# EAGLE design TeamH-PDS (EAGLE 9.6.2)
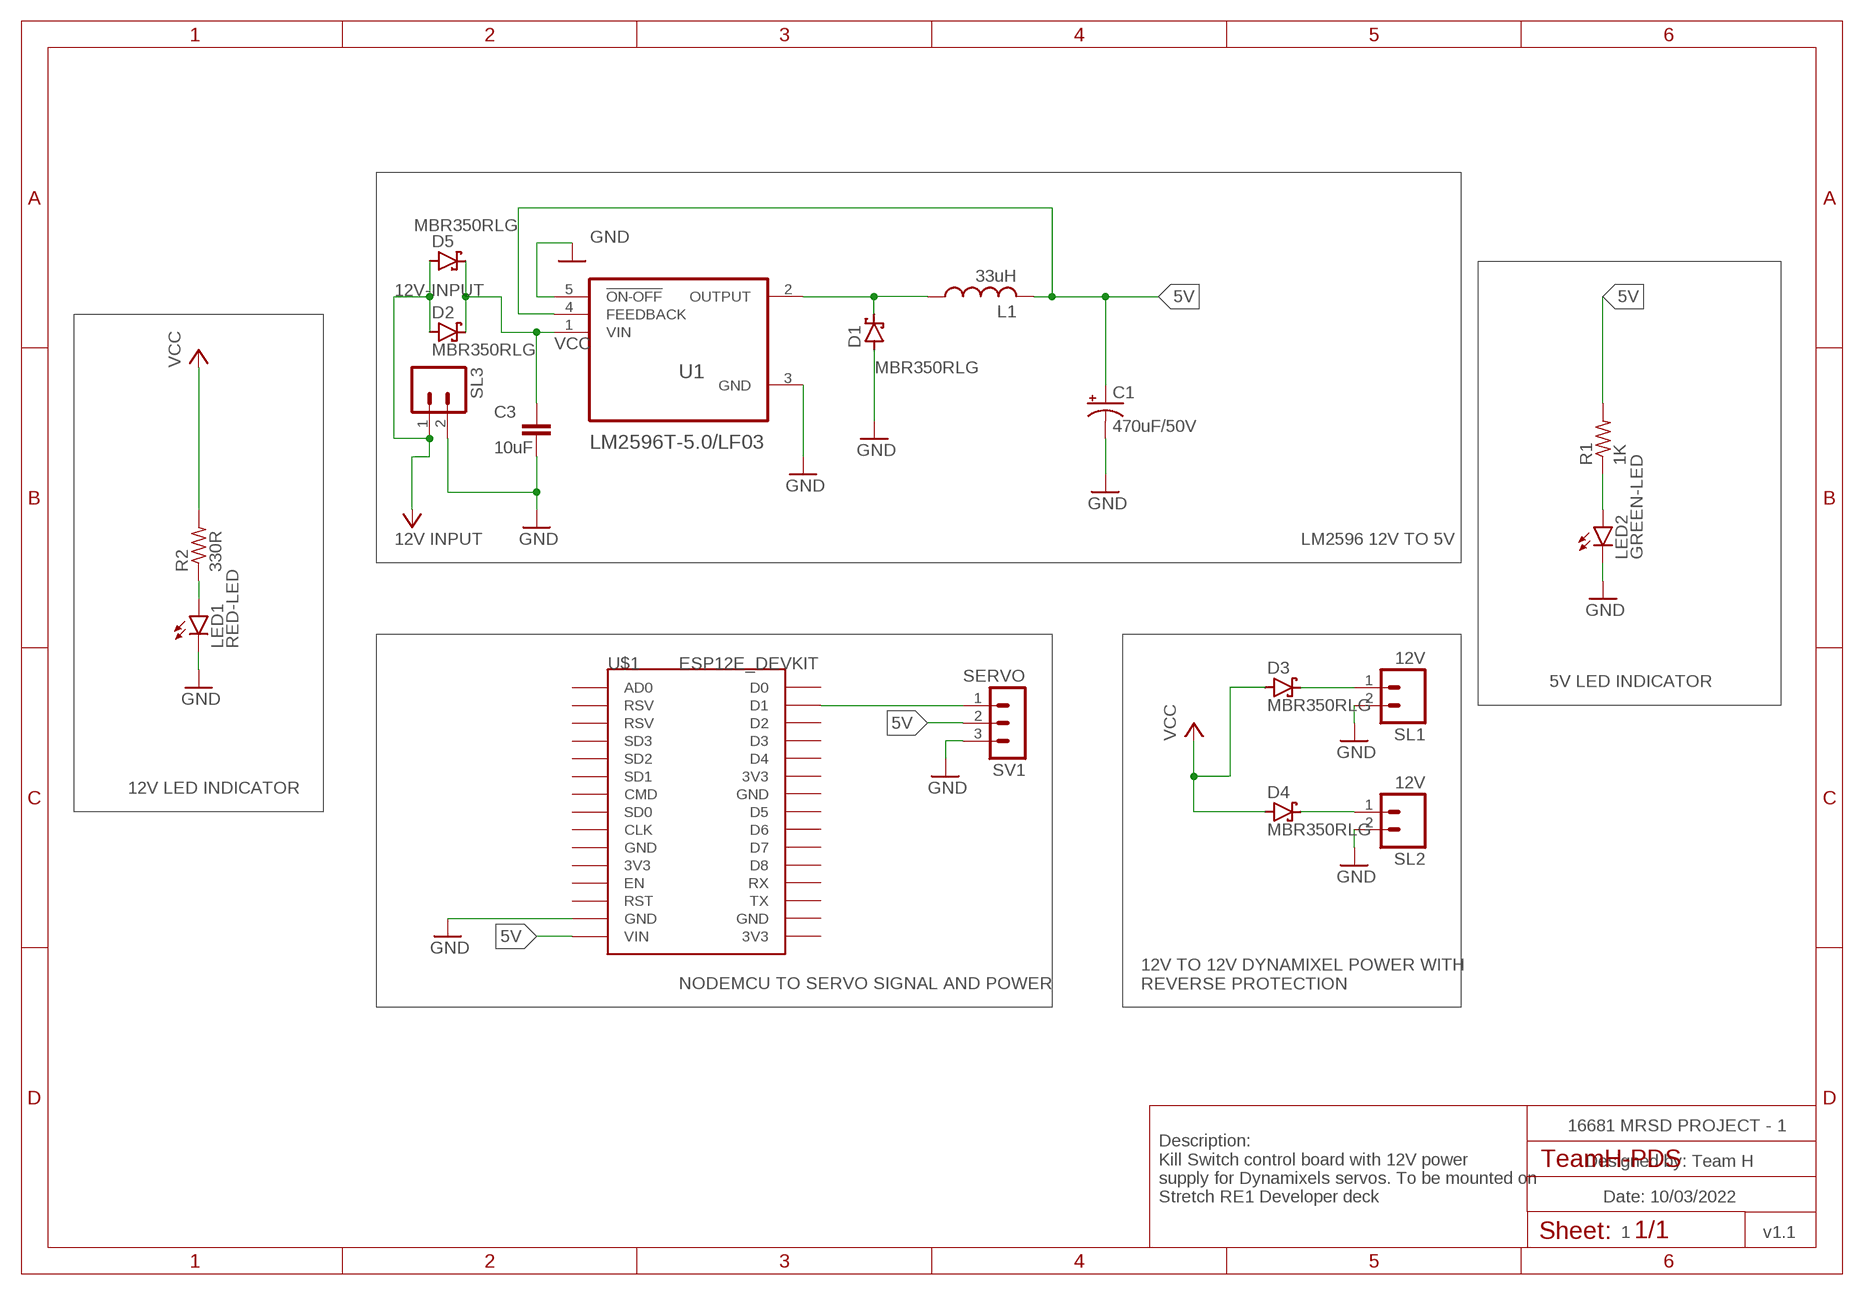
[diagram p0: schematic, sheet 1]

## Parts
C1  470uF/50V  CPOL-USE2-5  [E2-5]
C3  10uF  C2,5-3  [C2.5-3]
D1  MBR350RLG  1N5908  [C4111-15]
D2  MBR350RLG  1N5908  [C4111-15]
D3  MBR350RLG  1N5908  [C4111-15]
D4  MBR350RLG  1N5908  [C4111-15]
D5  MBR350RLG  1N5908  [C4111-15]
L1  33uH  L-US0207/7  [0207/7]
LED1  RED-LED  LED5MM  [LED5MM]
LED2  GREEN-LED  LED5MM  [LED5MM]
R1  1K  R-US_0204/5  [0204/5]
R2  330R  R-US_0204/5  [0204/5]
SL1  12V  M02  [02P]
SL2  12V  M02  [02P]
SL3  12V-INPUT  M02  [02P]
SV1  SERVO  MA03-1  [MA03-1]
U1  LM2596T-5.0/LF03  [TO170P1016X470X2092-5]
U$1  ESP12E_DEVKIT  [ESP12E_DEVKIT]

## Nets
5V: C1.+ L1.2 R1.2 SV1.2 U1.4(FEEDBACK) U$1.VIN
GND: C1.- C3.2 D1.A LED1.K(C) LED2.K(C) SL1.2 SL2.2 SL3.2 SV1.3 U1.3(GND) U1.5(!ON-OFF) U$1.GND@1(GND)
N$1: SV1.1 U$1.D1
N$3: D1.C L1.1 U1.2(OUTPUT)
N$4: LED1.A R2.1
N$5: D3.C SL1.1
N$6: D4.C SL2.1
N$7: C3.1 D2.C D5.C U1.1(VIN)
N$21: LED2.A R1.1
VCC: D2.A D3.A D4.A D5.A R2.2 SL3.1
Unconnected: U$1.3V3@0(3V3) U$1.3V3@1(3V3) U$1.3V3@2(3V3) U$1.AD0 U$1.CLK U$1.CMD U$1.D0 U$1.D2 U$1.D3 U$1.D4 U$1.D5 U$1.D6 U$1.D7 U$1.D8 U$1.EN U$1.GND@0(GND) U$1.GND@2(GND) U$1.GND@3(GND) U$1.RST U$1.RSV@0(RSV) U$1.RSV@1(RSV) U$1.RX U$1.SD0 U$1.SD1 U$1.SD2 U$1.SD3 U$1.TX

## Notes on the sheet
- 12V INPUT | LM2596 12V TO 5V
- 5V LED INDICATOR
- 12V LED INDICATOR
- NODEMCU TO SERVO SIGNAL AND POWER
- 12V TO 12V DYNAMIXEL POWER WITH 
  REVERSE PROTECTION
- 16681 MRSD PROJECT - 1
- Designed by: Team H
- Description:
  Kill Switch control board with 12V power 
  supply for Dynamixels servos. To be mounted on 
  Stretch RE1 Developer deck
- Date: 10/03/2022
- 1 | v1.1

## Library data of the parts
C1 = rcl:CPOL-US: POLARIZED CAPACITOR, American symbol; SPICEPREFIX: C
C3 = capacitor-wima:C: CAPACITOR naming: grid - package width
D1-D5 = diode:1N5908: DIODE schottky
L1 = rcl:L-US: INDUCTOR, American symbol; SPICEPREFIX: L
LED1 LED2 = led:LED: LED OSRAM: - CHIPLED LG R971, LG N971, LY N971, LG Q971, LY Q971, LO R971, LY R971 LH N974, LH R974 LS Q976, LO Q976, LY Q976 LO Q996 - Hyper CHIPLED LW Q18S LB Q993, LB Q99A, LB R99A - SideLED LS A670, LO A670, LY A670, LG A670, LP A670 LB A673, LV A673, LT A673, LW A673 LH A674 LY A675 LS A676, LA A676, LO A676, LY A676, LW A676 LS A679, LY A679, LG A679 - Hyper Micro SIDELED® LS Y876, LA Y876, LO Y876, LY Y876 LT Y87S - SmartLED LW L88C, LW L88S LB L89C, LB L89S, LG L890 LS L89K, LO L89K, LY L89K LS L896, LA L896, LO L896, LY L896 - TOPLED LS T670, LO T670, LY T670, LG T670, LP T670 LSG T670, LSP T670, LSY T670, LOP T670, LYG T670 LG T671, LOG T671, LSG T671 LB T673, LV T673, LT T673, LW T673 LH T674 LS T676, LA T676, LO T676, LY T676, LB T676, LH T676, LSB T676, LW T676 LB T67C, LV T67C, LT T67C, LS T67K, LO T67K, LY T67K, LW E67C LS E67B, LA E67B, LO E67B, LY E67B, LB E67C, LV E67C, LT E67C LW T67C LS T679, LY T679, LG T679 LS T770, LO T770, LY T770, LG T770, LP T770 LB T773, LV T773, LT T773, LW T773 LH T774 LS E675, LA E675, LY E675, LS T675 LS T776, LA T776, LO T776, LY T776, LB T776 LHGB T686 LT T68C, LB T68C - Hyper Mini TOPLED® LB M676 - Mini TOPLED Santana® LG M470 LS M47K, LO M47K, LY M47K Source: http://www.osram.convergy.de LUXEON: - LUMILED® LXK2-PW12-R00, LXK2-PW12-S00, LXK2-PW14-U00, LXK2-PW14-V00 LXK2-PM12-R00, LXK2-PM12-S00, LXK2-PM14-U00 LXK2-PE12-Q00, LXK2-PE12-R00, LXK2-PE12-S00, LXK2-PE14-T00, LXK2-PE14-U00 LXK2-PB12-K00, LXK2-PB12-L00, LXK2-PB12-M00, LXK2-PB14-N00, LXK2-PB14-P00, LXK2-PB14-Q00 LXK2-PR12-L00, LXK2-PR12-M00, LXK2-PR14-Q00, LXK2-PR14-R00 LXK2-PD12-Q00, LXK2-PD12-R00, LXK2-PD12-S00 LXK2-PH12-R00, LXK2-PH12-S00 LXK2-PL12-P00, LXK2-PL12-Q00, LXK2-PL12-R00 Source: www.luxeon.com KINGBRIGHT: KA-3528ASYC Source: www.kingbright.com
R1 R2 = rcl:R-US_: RESISTOR, American symbol; SPICEPREFIX: R
SL1-SL3 = con-amp-quick:M02: AMP QUICK CONNECTOR; OC_FARNELL: unknown; OC_NEWARK: unknown
SV1 = con-lstb:MA03-1: PIN HEADER; OC_FARNELL: unknown; OC_NEWARK: unknown
U1 = LM2596T-5.0_LF03:LM2596T-5.0/LF03: Check availability <https://pricing.snapeda.com/parts/LM2596T-5.0/LF03/Texas%20Instruments/view-part?ref=eda>; AVAILABILITY: In Stock; DESCRIPTION: SIMPLE SWITCHER&reg; 4.5V to 40V, 3A Low Component Count Step-Down Regulator 5-TO-220; MF: Texas Instruments; MP: LM2596T-5.0/LF03; PACKAGE: TO-220-5 Texas Instruments; PRICE: None; PURCHASE-URL: https://pricing.snapeda.com/search/part/LM2596T-5.0/LF03/?ref=eda
U$1 = ESP12E_DEVKIT:ESP12E_DEVKIT: ESP12E DEVKIT BOARD

## Net classes
0 default: width 0.762 mm

## Board
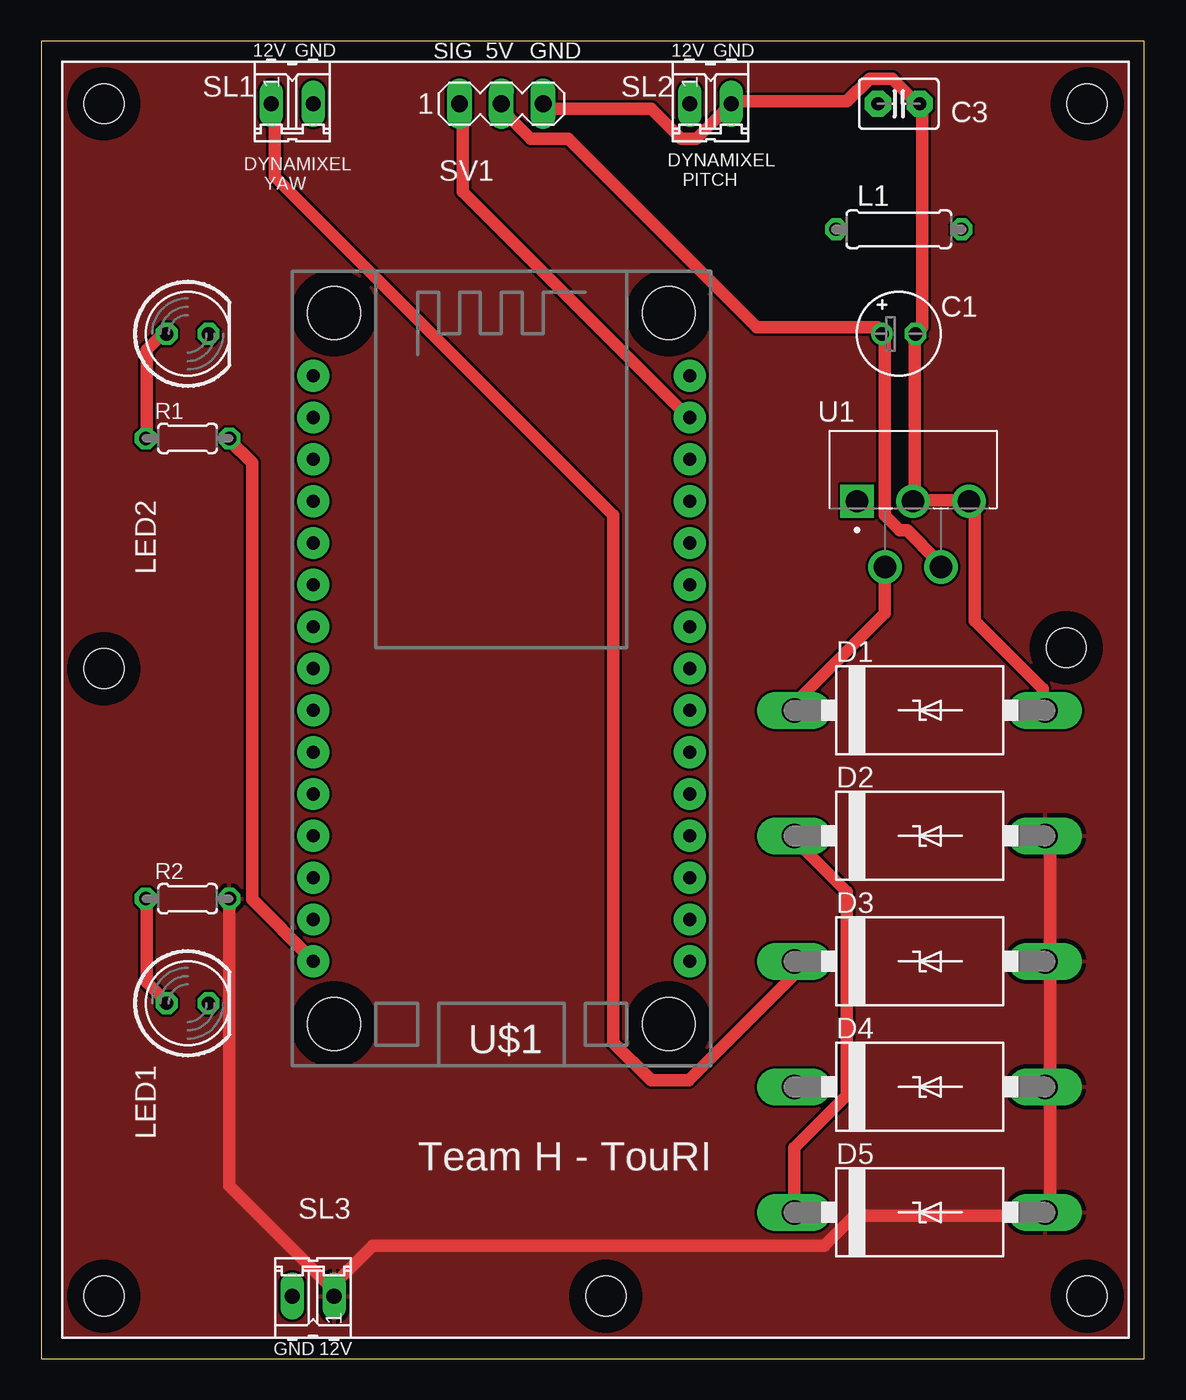
[diagram p1: board, top side]
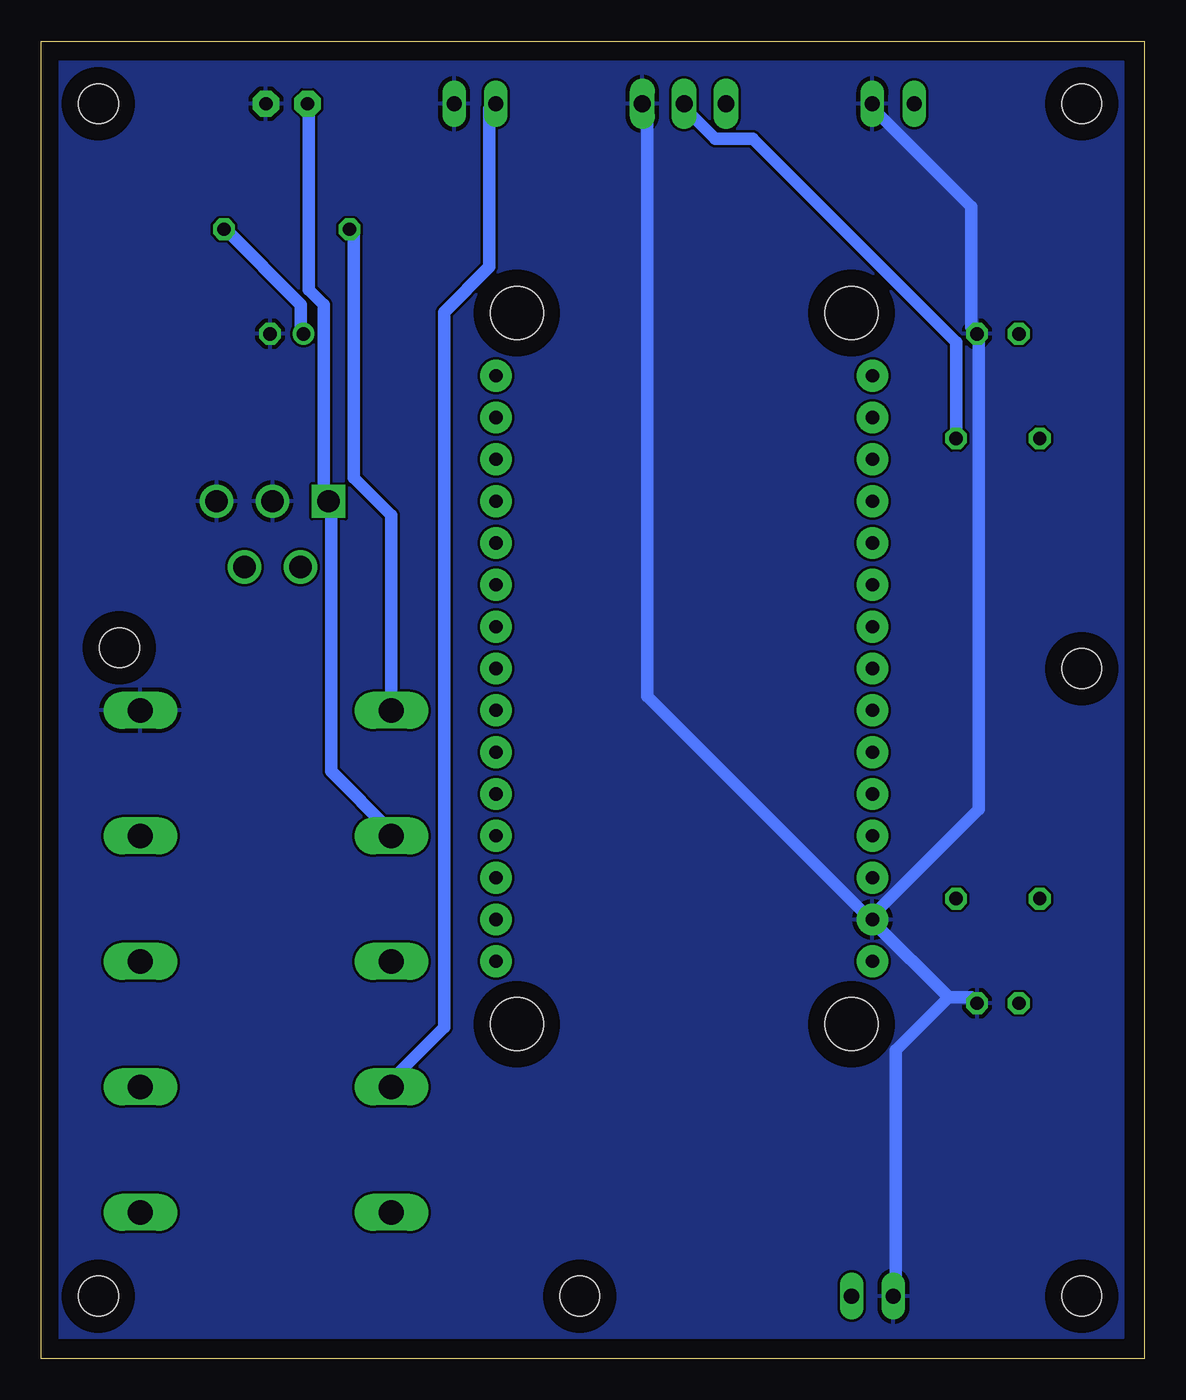
[diagram p2: board, bottom side, seen from below]

Size 66.98 x 80 mm. Coordinates in mm from the lower left corner, seen from the top.
Outline: 0,0 66.98,0 66.98,80 0,80 0,0
Copper layers (1*16): Top 0.035mm / dielectric 1.5mm / Bottom 0.035mm
Design rules "default": minimum track width 6mil, minimum drill 0.35mm, track to track 6mil, track to pad 6mil, pad to pad 6mil, via to via 6mil, smd to smd 6mil, copper to edge 40mil, drill to drill 6mil, minimum pad ring 10mil, minimum via ring 8mil, stop-mask expansion 4mil, vias tented up to drill 0mil, thermal gap 10mil
Holes 2.4 mm at 3.81,3.81 63.5,3.81 63.5,76.2 3.81,76.2 3.81,41.91 34.29,3.81 62.23,43.18

### Footprints (pad centres in the part's own frame; a part is rotated, then mirrored left to right if it is on the bottom)
E2-5 = drill 0.813 pad 1.27: + -1.016,0 | drill 0.813 pad 1.27 octagon: - 1.016,0
C2.5-3 = drill 0.813 pad 1.6 octagon: 1 -1.27,0; 2 1.27,0
C4111-15 = drill 1.499 long: A 7.62,0; C -7.62,0
0207/7 = drill 0.813 octagon: 1 -3.81,0; 2 3.81,0
LED5MM = drill 0.813 octagon: A -1.27,0; K 1.27,0
0204/5 = drill 0.813 octagon: 1 -2.54,0; 2 2.54,0
02P = drill 0.914 long: 1 -1.27,0; 2 1.27,0
MA03-1 = drill 1.016 long: 1 -2.54,0; 2 0,0; 3 2.54,0
TO170P1016X470X2092-5 = drill 1.35 square: 1 0,0 | drill 1.35: 2 1.7,-4; 3 3.4,0; 4 5.1,-4; 5 6.8,0
ESP12E_DEVKIT = drill 0.8 pad 1.93: 3V3@0 -11.43,-7.62; 3V3@1 11.43,5.08; 3V3@2 11.43,-17.78; AD0 -11.43,17.78; CLK -11.43,-2.54; CMD -11.43,2.54; D0 11.43,17.78; D1 11.43,15.24; D2 11.43,12.7; D3 11.43,10.16; D4 11.43,7.62; D5 11.43,0; D6 11.43,-2.54; D7 11.43,-5.08; D8 11.43,-7.62; EN -11.43,-10.16; GND@0 -11.43,-5.08; GND@1 -11.43,-15.24; GND@2 11.43,2.54; GND@3 11.43,-15.24; RST -11.43,-12.7; RSV@0 -11.43,15.24; RSV@1 -11.43,12.7; RX 11.43,-10.16; SD0 -11.43,0; SD1 -11.43,5.08; SD2 -11.43,7.62; SD3 -11.43,10.16; TX 11.43,-12.7; VIN -11.43,-17.78 | hole 3.2: -10.16,21.59; 10.16,21.59; 10.16,-21.59; -10.16,-21.59

### Placement (x,y rotation side)
C1  52.07,62.23 0 top
C3  52.07,76.2 0 top
D1  53.34,39.37 0 top
D2  53.34,31.75 0 top
D3  53.34,24.13 0 top
D4  53.34,16.51 0 top
D5  53.34,8.89 0 top
L1  52.07,68.58 0 top
LED1  8.89,21.59 0 top
LED2  8.89,62.23 0 top
R1  8.89,55.88 0 top
R2  8.89,27.94 0 top
SL1  15.24,76.2 0 top
SL2  40.64,76.2 0 top
SL3  16.51,3.81 180 top
SV1  27.94,76.2 0 top
U1  49.53,52.07 0 top
U$1  27.94,41.91 0 top

### Tracks (layer width: path | path; a pad name or v marks a point on that pad's centre or on a via)
5V
  Top 0.762: U1.4 54.41,48.46 52.58,50.29 52.12,50.29 51.21,51.21 51.21,62.18 C1.+ 50.75,62.64 43.43,62.64 32,74.07 29.72,74.07 27.89,75.89 SV1.2 | U$1.VIN 16.46,24.23 12.8,27.89 12.8,54.41 11.43,55.78 R1.2
  Bottom 0.762: C1.+ 51.21,62.64 51.21,64.01 55.78,68.58 L1.2 | R1.2 11.43,61.72 23.77,74.07 26.06,74.07 27.89,75.89 SV1.2
GND
  Top 0.762: SV1.3 30.63,75.89 37.03,75.89 38.86,74.07 39.78,74.07 SL2.2 42.06,76.35 48.92,76.35 50.29,77.72 51.66,77.72 53.03,76.35 C3.2 53.49,75.89 53.49,62.64 C1.- 53.03,62.18 53.03,52.12 | 53.03,52.12 56.24,52.12 U1.5 56.69,51.66 56.69,44.81 60.81,40.69 60.81,39.78 D1.A | 53.03,52.12 U1.3
  Bottom 0.762: SL1.2 16.46,75.89 10.52,69.95 10.52,62.64 LED2.K 10.06,62.18 10.06,33.38 16.46,26.98 U$1.GND@1 | 11.89,21.95 10.52,21.95 LED1.K | 11.89,21.95 16.46,26.52 U$1.GND@1 | 11.89,21.95 15.09,18.75 15.09,4.12 SL3.2 | SV1.3 30.18,75.89 30.18,40.23 16.92,26.98 U$1.GND@1
  pour Bottom: 1.27,78.74 66.04,78.74 66.04,1.27 1.27,1.27
N$1
  Top 0.762: SV1.1 25.6,75.89 25.6,70.87 39.32,57.15 U$1.D1
N$3
  Top 0.762: U1.2 51.21,48.01 51.21,45.26 45.72,39.78 D1.C
  Bottom 0.762: D1.C 45.72,51.21 48.01,53.49 48.01,68.58 L1.1
N$4
  Top 0.762: R2.1 6.4,27.89 6.4,22.86 7.32,21.95 LED1.A
N$5
  Top 0.762: D3.C 45.72,23.32 39.32,16.92 37.03,16.92 34.75,19.2 34.75,51.21 14.17,71.78 14.17,75.89 SL1.1
N$6
  Bottom 0.762: SL2.1 39.78,75.89 39.78,66.29 42.52,63.55 42.52,20.12 45.72,16.92 D4.C
N$7
  Top 0.762: D5.C 45.72,12.8 48.92,16 48.92,28.35 45.72,31.55 D2.C
  Bottom 0.762: C3.1 50.75,75.89 50.75,64.92 49.84,64.01 49.84,52.12 U1.1 49.38,51.66 49.38,35.66 45.72,32 D2.C
N$21
  Top 0.762: R1.1 6.4,56.24 6.4,61.27 7.32,62.18 LED2.A
VCC
  Top 0.762: D2.A 61.27,31.55 61.27,24.23 D3.A 61.27,23.77 61.27,16.92 D4.A 61.27,16.46 61.27,9.14 D5.A 60.81,8.69 49.38,8.69 47.55,6.86 20.12,6.86 17.83,4.57 SL3.1 17.83,4.12 11.43,10.52 R2.2
  pour Top: 1.27,78.74 66.04,78.74 66.04,1.27 1.27,1.27

### Text on the board
tNames: 12V | GND | SIG | 5V | GND | 12V | GND | DYNAMIXEL / YAW | DYNAMIXEL / PITCH | Team H - TouRI | GND | 12V